# Altium schematic sheet IRFB7440PBF1_IRFB7440PBF.schdoc
size 127 x 101 mm
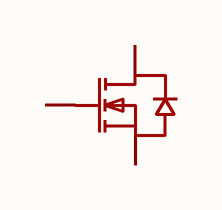
[diagram p0: IRFB7440PBF1_IRFB7440PBF.schdoc]

## Parts
Q?  IRFB7440PBF  [TO-220-3_L10.0-W4.5-P2.54-L]  (value not drawn)

## Nets

Not connected (* = marked no-connect by the designer): Q? 1(G) 2(D) 3(S)

## Library data of the parts
Q? = IRFB7440PBF: Manufacturer: Infineon(英飞凌); Add into BOM: yes; Number: 1 N-Channel; Drain to Source Voltage: 40V; Current - Continuous Drain(Id): 172A; RDS(on): 2.5mΩ@10V,100A; Pd - Power Dissipation: 143W; Gate Threshold Voltage (Vgs(th)): 3.9V; Gate Charge(Qg): 135nC@10V; Input Capacitance(Ciss): 4.73nF; Reverse Transfer Capacitance (Crss@Vds): 460pF; Symbol: IRFB7440PBF; Device: IRFB7440PBF; LCSC Part Name: 1个N沟道 耐压:40V 电流:172A; Supplier Part: C48044; Manufacturer Part: IRFB7440PBF; Supplier Footprint: TO-220AB; JLCPCB Part Class: Extended Part; Datasheet: https://item.szlcsc.com/datasheet/IRFB7440PBF/49050.html; Supplier: LCSC; Convert to PCB: yes; Operating Temperature: -55℃~+175℃